# Altium schematic sheet MOTO.SchDoc
size A3
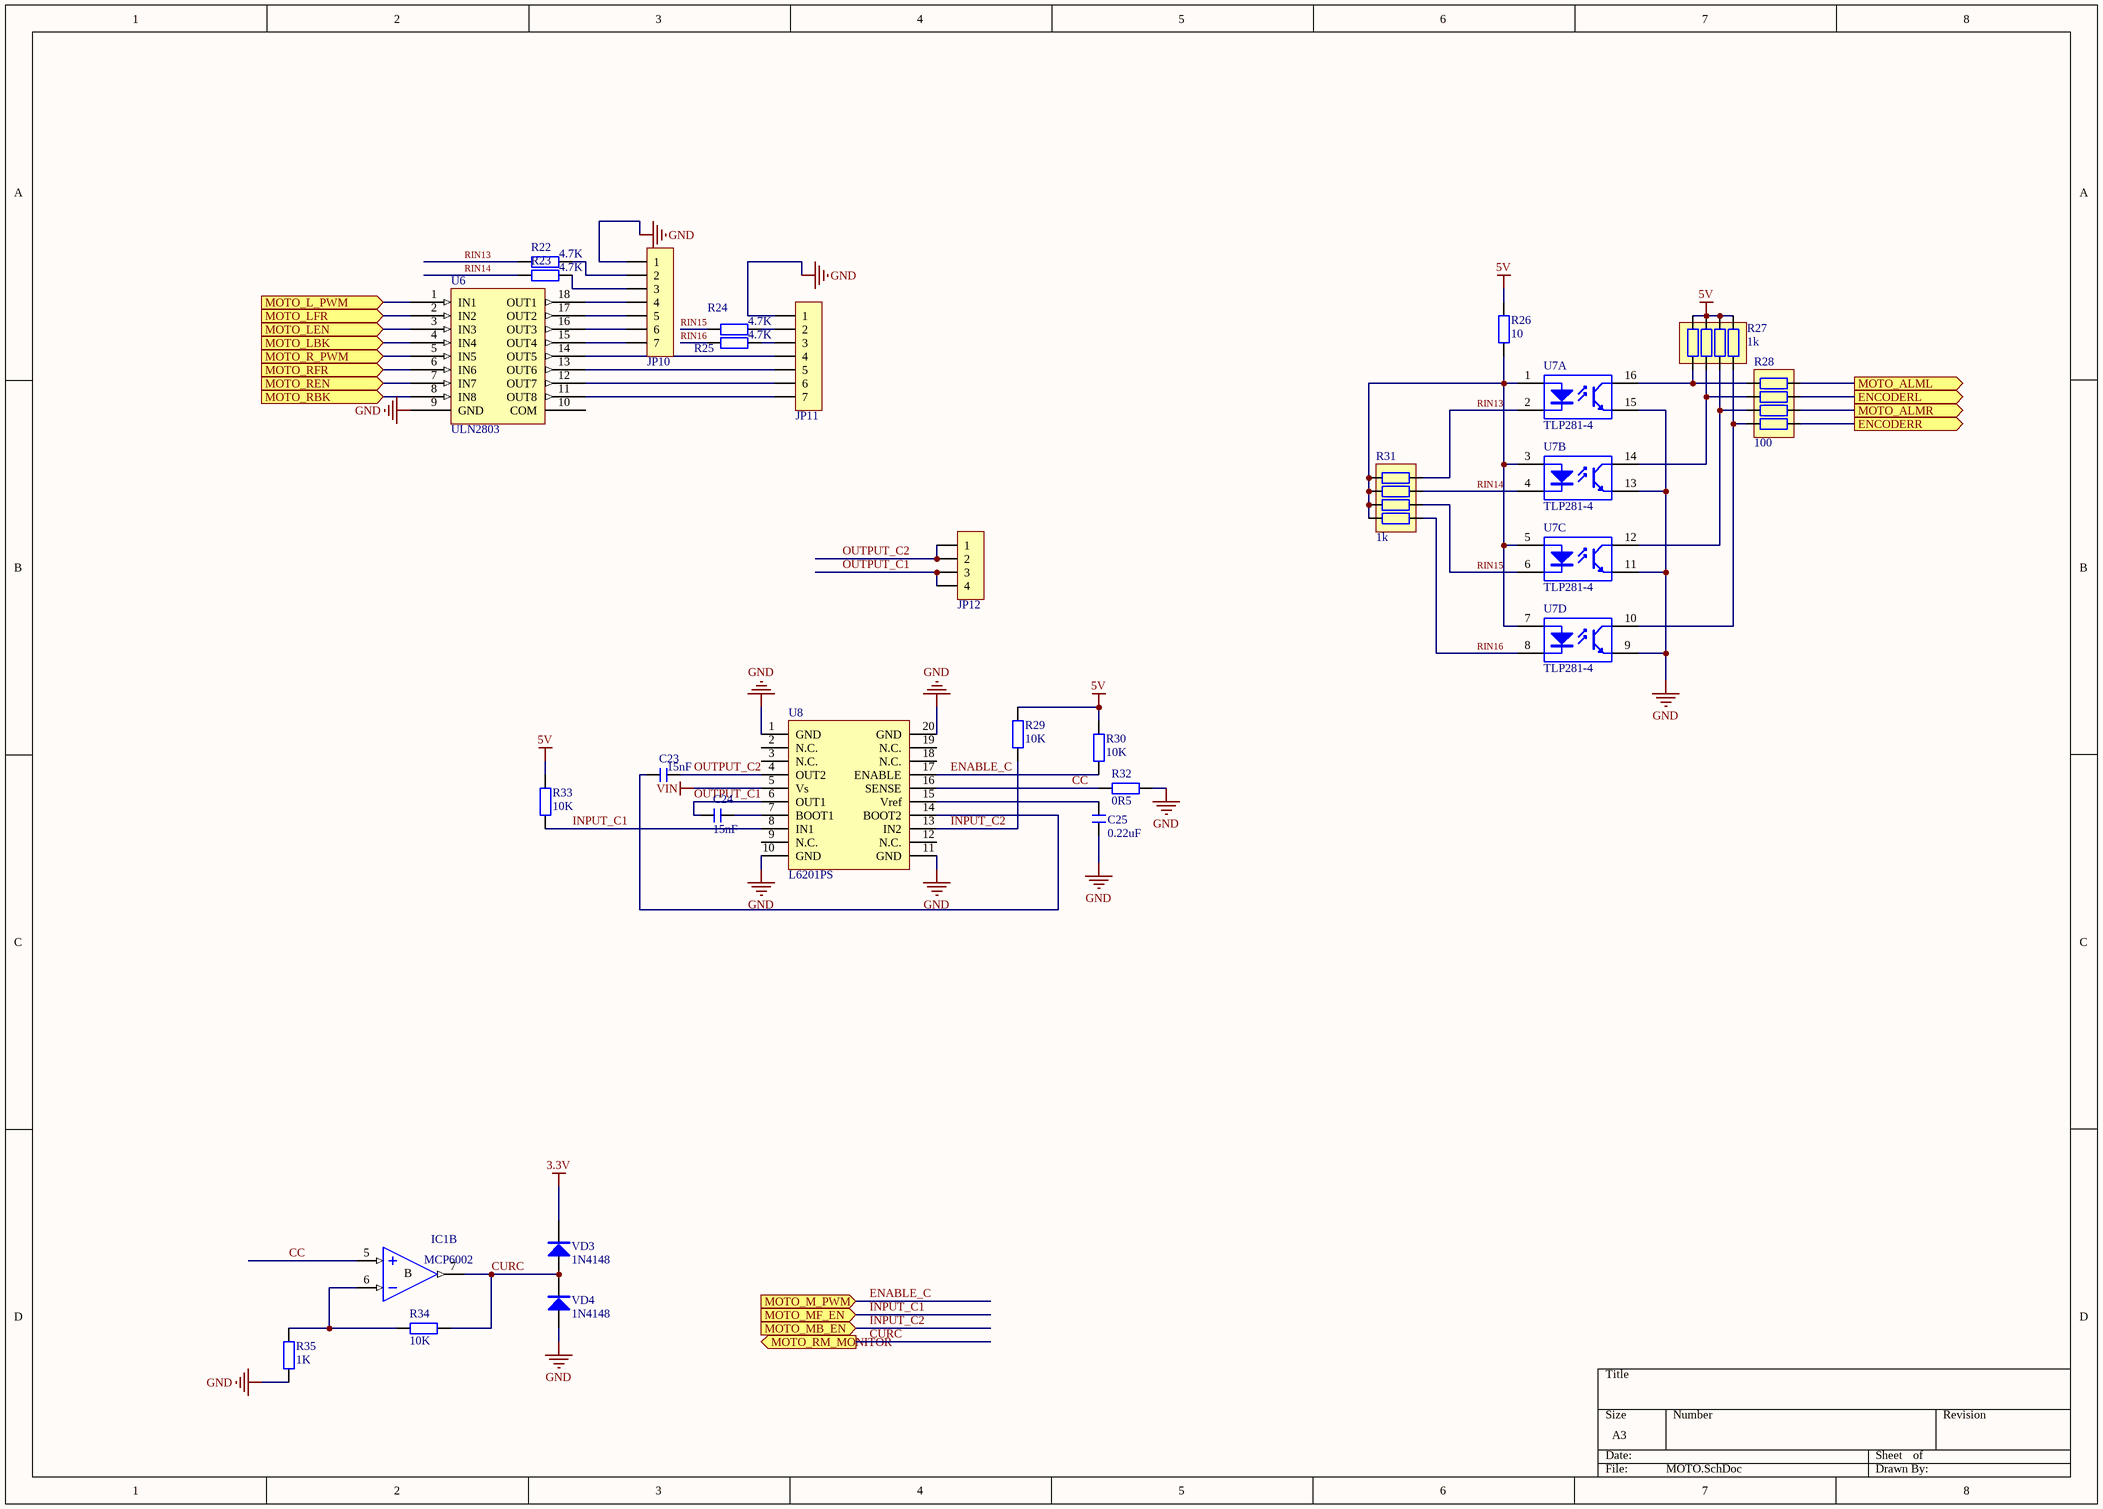
[diagram p0: MOTO.SchDoc]

## Parts
C23  15nF  [C 0603_L]
C24  15nF  [C 0603_L]
C25  0.22uF  [C 0603_L]
IC1  MCP6002  [SOP8_N]  (part B of 2)
JP10  HDR-1X7  [XH2.54-WI-7P]  (value not drawn)
JP11  HDR-1X7  [XH2.54-WI-7P]  (value not drawn)
JP12  HDR-1X4  [XH2.54-WI-4P]  (value not drawn)
R22  4.7K  [R 0603_L]
R23  4.7K  [R 0603_L]
R24  4.7K  [R 0603_L]
R25  4.7K  [R 0603_L]
R26  10  [R 0603_L]
R27  1k  [RCA-8P4R-0603]
R28  100  [RCA-8P4R-0603]
R29  10K  [R 0603_L]
R30  10K  [R 0603_L]
R31  1k  [RCA-8P4R-0603]
R32  0R5  [RS 3W-V7]
R33  10K  [R 0603_L]
R34  10K  [R 0603_L]
R35  1K  [R 0603_L]
U6  ULN2803  [SO-G18]
U7  TLP281-4  [SOP16N_N]  (parts A,B,C,D of 4)
U8  L6201PS  [SO_PowerSO20]
VD3  1N4148  [SOD-323]
VD4  1N4148  [SOD-323]

## Ports
ENCODERL (out), ENCODERR (out), MOTO_ALML (out), MOTO_ALMR (out), MOTO_L_PWM (in), MOTO_LBK (in), MOTO_LEN (in), MOTO_LFR (in), MOTO_M_PWM (in), MOTO_MB_EN (in), MOTO_MF_EN (in), MOTO_R_PWM (in), MOTO_RBK (in), MOTO_REN (in), MOTO_RFR (in), MOTO_RM_MONITOR (out)

## Nets
3.3V: VD3.2(K)
5V: R26.1 R27.5 R27.6 R27.7 R27.8 R29.2 R30.2 R33.2
GND: C25.1 JP10.1 JP11.1 R32.2 R35.1 U6.9(GND) U7.9 U7.11 U7.13 U7.15 U8.1(GND) U8.10(GND) U8.11(GND) U8.20(GND) VD4.1(A)
VIN: U8.5(Vs)
CC: IC1.5(IN+) R32.1 U8.16(SENSE)
CURC: IC1.7(OUT) R34.2 VD3.1(A) VD4.2(K) ; port MOTO_RM_MONITOR
ENABLE_C: R30.1 U8.17(ENABLE) ; port MOTO_M_PWM
ENCODERL: R28.2 ; port ENCODERL
ENCODERR: R28.4 ; port ENCODERR
INPUT_C1: R33.1 U8.8(IN1) ; port MOTO_MF_EN
INPUT_C2: R29.1 U8.13(IN2) ; port MOTO_MB_EN
MOTO_ALML: R28.1 ; port MOTO_ALML
MOTO_ALMR: R28.3 ; port MOTO_ALMR
MOTO_L_PWM: U6.1(IN1) ; port MOTO_L_PWM
MOTO_LBK: U6.4(IN4) ; port MOTO_LBK
MOTO_LEN: U6.3(IN3) ; port MOTO_LEN
MOTO_LFR: U6.2(IN2) ; port MOTO_LFR
MOTO_R_PWM: U6.5(IN5) ; port MOTO_R_PWM
MOTO_RBK: U6.8(IN8) ; port MOTO_RBK
MOTO_REN: U6.7(IN7) ; port MOTO_REN
MOTO_RFR: U6.6(IN6) ; port MOTO_RFR
OUTPUT_C1: C24.1 JP12.3 JP12.4 U8.6(OUT1)
OUTPUT_C2: C23.2 JP12.1 JP12.2 U8.4(OUT2)
RIN13: R22.2 R31.8 U7.2
RIN14: R23.2 R31.7 U7.4
RIN15: R24.2 R31.6 U7.6
RIN16: R25.2 R31.5 U7.8
NetC23_1: C23.1 U8.14(BOOT2)
NetC24_2: C24.2 U8.7(BOOT1)
NetC25_2: C25.2 U8.15(Vref)
NetIC1_6: IC1.6(IN-) R34.1 R35.2
NetJP10_2: JP10.2 R22.1
NetJP10_3: JP10.3 R23.1
NetJP10_4: JP10.4 U6.18(OUT1)
NetJP10_5: JP10.5 U6.17(OUT2)
NetJP10_6: JP10.6 U6.16(OUT3)
NetJP10_7: JP10.7 U6.15(OUT4)
NetJP11_2: JP11.2 R24.1
NetJP11_3: JP11.3 R25.1
NetJP11_4: JP11.4 U6.14(OUT5)
NetJP11_5: JP11.5 U6.13(OUT6)
NetJP11_6: JP11.6 U6.12(OUT7)
NetJP11_7: JP11.7 U6.11(OUT8)
NetR26_2: R26.2 R31.1 R31.2 R31.3 R31.4 U7.1 U7.3 U7.5 U7.7
NetR27_1: R27.1 R28.8 U7.16
NetR27_2: R27.2 R28.7 U7.14
NetR27_3: R27.3 R28.6 U7.12
NetR27_4: R27.4 R28.5 U7.10

Not connected (* = marked no-connect by the designer): U6 10(COM); U8 2(N.C.) 3(N.C.) 9(N.C.) 12(N.C.) 18(N.C.) 19(N.C.)

## Notes on the sheet
- (in symbol LM358, part B) B

## Library data of the parts
C23-C25 = C: 无极性贴片电容; 版权归属: 源创客; BOM名称: 无极性贴片电容; 学习资源: www.ooocke.com
IC1 = LM358: 双路运放; 版权归属: 源创客; BOM名称: 双路运放; 学习资源: www.ooocke.com
JP10 JP11 = Header 7: 7P接插件; 版权归属: 源创客; BOM名称: 7P接插件; 学习资源: www.ooocke.com
JP12 = Header 4: 4P接插件; 版权归属: 源创客; BOM名称: 4P接插件; 学习资源: www.ooocke.com
R22-R26 R29 R30 R33-R35 = R: 贴片电阻; 版权归属: 源创客; BOM名称: 贴片电阻; 学习资源: www.ooocke.com
R27 R28 R31 = R-8P4R: 贴片网络排阻; 版权归属: 源创客; BOM名称: 贴片网络排阻; 学习资源: www.ooocke.com
R32 = R-CRR: 直插色环电阻; BOM名称: 色环电阻; 版权归属: 源创客; 学习资源: www.ooocke.com
U8 = L6201PS: 电机驱动H桥
VD3 VD4 = 1N4148: 高速开关二极管; 版权归属: 源创客; BOM名称: 高速开关二极管; 学习资源: www.ooocke.com